# Altium schematic sheet 03_MCU.SchDoc: ECE315 MCU
size A; Date: 4/25/2017; ApprovedBy: JSK; CheckedBy: JSK; Author: JSK; CompanyName: University of Wisconsin; DrawnBy: JSK; Engineer: JSK; Organization: ECE 315; Address1: College of Engineering; Address2: 1415 Engineering Drive; Address3: Madison, WI 53706; Address4: ECE 315 Fall 2017; Revision: A; SheetNumber: 3; SheetTotal: 6; AssemblyNumber: 0; MachineName: ECE315-S19; PCBNumber: 001; ApprovedDate: 1/17/2019
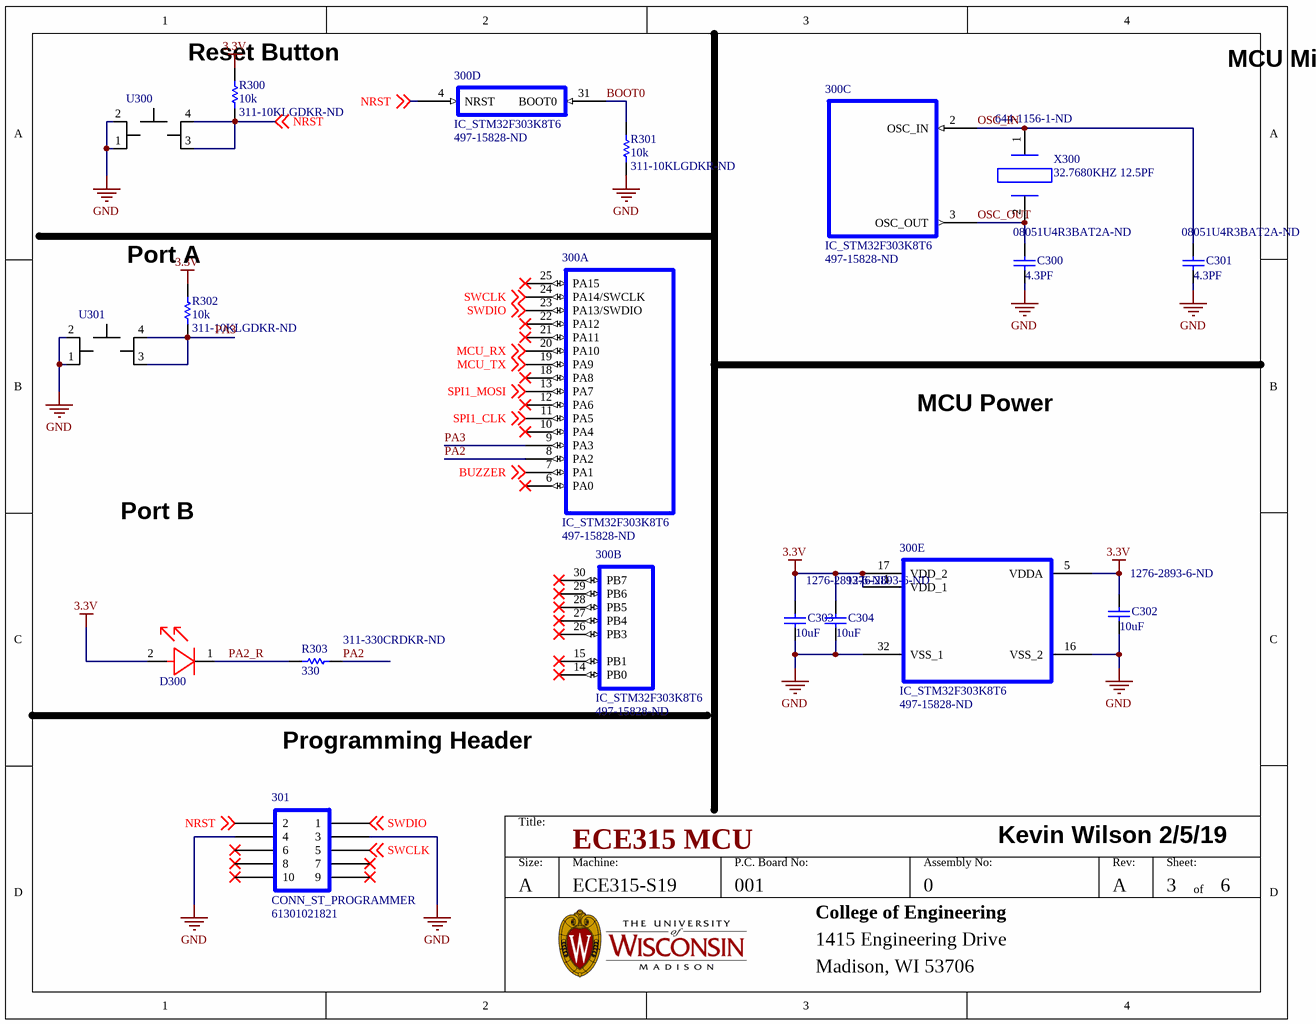
[diagram p0: 03_MCU.SchDoc]

## Parts
300  IC_STM32F303K8T6  Supplier Part Number 1: 497-15828-ND  [IC_STM32FM]  (parts A,B,C,D,E of 5)
301  CONN_ST_PROGRAMMER  Manufacturer Part Number: 61301021821  [CONN_ST_PROGRAMMER]
C300  4.3PF  Supplier Part Number 1: 08051U4R3BAT2A-ND  [CAP_0805]
C301  4.3PF  Supplier Part Number 1: 08051U4R3BAT2A-ND  [CAP_0805]
C302  10uF  Supplier Part Number 1: 1276-2893-6-ND  [CAP_0805]
C303  10uF  Supplier Part Number 1: 1276-2893-6-ND  [CAP_0805]
C304  10uF  Supplier Part Number 1: 1276-2893-6-ND  [CAP_0805]
D300  LED_RED_0805.1  [LED_RED_0805]  (value not drawn)
R300  Supplier Part Number 1: 311-10KLGDKR-ND  [RES_0805]  (hidden comment: 10K)
R301  Supplier Part Number 1: 311-10KLGDKR-ND  [RES_0805]  (hidden comment: 10K)
R302  Supplier Part Number 1: 311-10KLGDKR-ND  [RES_0805]  (hidden comment: 10K)
R303  Supplier Part Number 1: 311-330CRDKR-ND  [RES_0805]  (hidden comment: 330)
U300  SWITCH_6mm_6mm_smd  [SW_6mm_6mm_SMT]  (value not drawn)
U301  SWITCH_6mm_6mm_smd  [SW_6mm_6mm_SMT]  (value not drawn)
X300  32.7680KHZ 12.5PF  Supplier Part Number 2: 644-1156-1-ND  [NX3215SA-32.768K-STD-MUA-8]

## Nets
3.3V: 300.1(VDD_1) 300.5(VDDA) 300.17(VDD_2) C302.1 C303.1 C304.1 D300.2(Anode) R300.2 R302.2
GND: 300.16(VSS_2) 300.32(VSS_1) 301.?2(3) 301.?9(4) C300.1 C301.1 C302.2 C303.2 C304.2 R301.1 U300.1 U300.2 U301.1 U301.2
BOOT0: 300.31(BOOT0) R301.2
BUZZER: 300.7(PA1) ; off-sheet BUZZER
MCU_RX: 300.20(PA10) ; off-sheet MCU_RX
MCU_TX: 300.19(PA9) ; off-sheet MCU_TX
NRST: 300.4(NRST) 301.?10(2) R300.1 U300.3 U300.4(VCCIO) ; off-sheet NRST
OSC_IN: 300.2(OSC_IN) C301.2 X300.1
OSC_OUT: 300.3(OSC_OUT) C300.2 X300.2
PA2: 300.8(PA2) R303.1
PA2_R: D300.1(Cathode) R303.2
PA3: 300.9(PA3) R302.1 U301.3 U301.4(VCCIO)
SPI1_CLK: 300.11(PA5) ; off-sheet SPI1_CLK
SPI1_MOSI: 300.13(PA7) ; off-sheet SPI1_MOSI
SWCLK: 300.24(PA14/SWCLK) 301.?3(5) ; off-sheet SWCLK
SWDIO: 300.23(PA13/SWDIO) 301.?1(1) ; off-sheet SWDIO

Not connected (* = marked no-connect by the designer): 300 6(PA0)* 10(PA4)* 12(PA6)* 14(PB0)* 15(PB1)* 18(PA8)* 21(PA11)* 22(PA12)* 25(PA15)* 26(PB3)* 27(PB4)* 28(PB5)* 29(PB6)* 30(PB7)*; 301 ?4(7)* ?5(9)* ?6(10)* ?7(8)* ?8(6)*

## Notes on the sheet
- Reset Button
- MCU Misc
- Port A
- MCU Power
- Port B
- Programming Header
- Kevin Wilson 2/5/19
- Title:
- Size:
- A
- Machine:
- P.C. Board No:
- Assembly No:
- Rev:
- Sheet:
- of
- College of Engineering
- 1415 Engineering Drive
- Madison, WI 53706

## Library data of the parts
301 = CONN_ST_PROGRAMMER: Manufacturer: Wurth Electronics; Current Rating: 3A; Voltage Rating: 250V; Number of Positions: 10; Insulation Resistance: 1GR; Gender: Receptacle; Connector Type: Header,Socket; Pitch: 2.54mm; Row Spacing: 0.1inch; Supplier 1: Digi-Key; Stock 1: 1798; Pricing 1: 1=0.74, 10=0.728, 50=0.672, 100=0.616, 320=0.56 (USD); Mount: Through Hole; Contact Plating: Gold; Housing Material: PBT; Contact Material: Copper,Copper Alloy; Color: Black; Min Operating Temperature: -40°C; Max Operating Temperature: 125°C; Number of Rows: 2; Contact Gender: Female; Packaging: Tray; Package Quantity: 320; Termination: Solder; Number of Contacts: 10; Length: 5.08mm; Height: 12.5mm; Width: 13.2mm; REACH SVHC: Unknown; Flammability Rating: UL94 V-0; ComponentLink1URL: http://www.mouser.com/ds/2/445/6130xx21821-537816.pdf; ComponentLink1Description: http://www.mouser.com/ds/2/445/6130xx21821-537816.pdf; ComponentLink2URL: https://katalog.we-online.de/em/datasheet/6130xx21821.pdf; ComponentLink2Description: https://katalog.we-online.de/em/datasheet/6130xx21821.pdf; ComponentLink3URL: http://www.farnell.com/datasheets/1442176.pdf; ComponentLink3Description: http://www.farnell.com/datasheets/1442176.pdf; Supplier Part Number 1: 732-2861-ND
C300 C301 = CAP_0805_P_004.30: CAP CER 4.3PF 100V NP0 0805; Manufacturer: Kyocera AVX; Manufacturer Part Number: 08051U4R3BAT2A; Dielectric: C0G; ComponentLink1URL: https://datasheet.ciiva.com/204/ccog-204944.pdf; ComponentLink1Description: https://datasheet.ciiva.com/204/ccog-204944.pdf; ComponentLink2URL: https://datasheet.ciiva.com/11570/ccog-11570969.pdf; ComponentLink2Description: https://datasheet.ciiva.com/11570/ccog-11570969.pdf; Supplier 1: Digi-Key; Stock 1: 0; Pricing 1: 4000=0.14663 (USD); Mount: Surface Mount; Case/Package: 0805; Case Code (Imperial): 0805; Case Code (Metric): 2012; Min Operating Temperature: -55°C; Max Operating Temperature: 125°C; Capacitance: 4.3pF; Package Quantity: 4000; Voltage Rating: 100V; Voltage Rating (DC): 100V; Packaging: Tape and Reel; Termination: SMD/SMT; Composition: Ceramic; Length: 2.01mm; Height: 1.02mm; Width: 1.25mm; Thickness: 0.045inch; Depth: 1.25mm; Radiation Hardening: No; ComponentLink3URL: http://datasheets.avx.com/U-Series.pdf; ComponentLink3Description: http://datasheets.avx.com/U-Series.pdf; ComponentLink4URL: http://www.avxcorp.com/docs/Catalogs/useries.pdf; ComponentLink4Description: http://www.avxcorp.com/docs/Catalogs/useries.pdf
C302-C304 = CAP_0805_U_010.00: CAP CER 10UF 16V X5R 0805; Manufacturer: Samsung; Manufacturer Part Number: CL21A106KOFNNNE; Tolerance: 10%; ComponentLink3URL: https://datasheet.ciiva.com/26920/getdatasheetpartid-355170-26920201.pdf; ComponentLink3Description: https://datasheet.ciiva.com/26920/getdatasheetpartid-355170-26920201.pdf; ComponentLink1URL: https://datasheet.ciiva.com/25730/cl21a106kpclqnc-25730594.pdf; ComponentLink1Description: https://datasheet.ciiva.com/25730/cl21a106kpclqnc-25730594.pdf; Mount: Surface Mount; Case/Package: 0805; Case Code (Metric): 2012; Case Code (Imperial): 0805; Min Operating Temperature: -55°C; Max Operating Temperature: 85°C; Packaging: Tape and Reel; Capacitance: 10uF; Voltage Rating: 16V; Package Quantity: 2000; Dielectric: X5R; Length: 2mm; Height: 1.25mm; Width: 0.049inch; Thickness: 0.053inch; Depth: 1.25mm; Radiation Hardening: No; ComponentLink2URL: http://www.samsungsem.com/kr/support/product-search/mlcc/CL21A106KOFNNNE.jsp; ComponentLink2Description: http://www.samsungsem.com/kr/support/product-search/mlcc/CL21A106KOFNNNE.jsp; ComponentLink4URL: http://www1.futureelectronics.com/doc/SAMSUNG/CL21A106KOFNNNE.pdf; ComponentLink4Description: http://www1.futureelectronics.com/doc/SAMSUNG/CL21A106KOFNNNE.pdf; ComponentLink5URL: https://www.verical.com/server-webapp/html/getDatasheet?partID=354009; ComponentLink5Description: https://www.verical.com/server-webapp/html/getDatasheet?partID=354009; Supplier 1: Digi-Key; Stock 1: 1158169; Pricing 1: 1=0.29, 10=0.199, 100=0.1009, 500=0.06904, 1000=0.06107 (USD)
D300 = LED_RED_0805.1: LED SUPER RED CLR THIN 0805 SMD; Manufacturer: Vishay / Lite-On; Manufacturer Part Number: LTST-C171KRKT; Chip Material: AlGaInP; DELETED: Compliant; Dominant Wave Length: 631 nm; Forward Current: 30 mA; Forward Voltage: 2.4 V; High Brightness: Yes; Lum Intensity: 54mcd; Main Category: Chip LED; Number of  Elements: 1; Peak Wavelength: 639 nm; Power Dissipation: 75 W; Product Depth (mm): 1.25 mm; Product Height (mm): 0.8 mm; Product Length (mm): 2 mm; Rad Hardened: No; Reverse Voltage: 5 V; Shape Type: Rectangular; Test Current (It): 20 mA; Type: Uni-Color; Viewing Angle: 130 deg; Supplier 1: Digi-Key; Emitting Color: Red; Lens Dimensions: 1.4x1.25x0.5 mm; Luminous Intensity: 54mcd; Mounting: Surface Mount; Operating Temp Range: -55C to 85C; Operating Temperature Classification: Industrial; Package Type: Chip Led; Packaging: Tape and Reel; Pin Count: 2; ComponentLink1URL: https://datasheet.ciiva.com/2110/s-110-ltst-c171krkt-2110066.pdf; ComponentLink1Description: https://datasheet.ciiva.com/2110/s-110-ltst-c171krkt-2110066.pdf; ComponentLink2URL: https://datasheet.ciiva.com/2110/s-110-ltst-c171krkt-2110067.pdf; ComponentLink2Description: https://datasheet.ciiva.com/2110/s-110-ltst-c171krkt-2110067.pdf; ComponentLink3URL: https://datasheet.ciiva.com/2110/s-110-ltst-c171krkt-2110068.pdf; ComponentLink3Description: https://datasheet.ciiva.com/2110/s-110-ltst-c171krkt-2110068.pdf; ComponentLink4URL: https://datasheet.ciiva.com/12403/lite-on-ltst-c171krkt-187201-12403781.pdf; ComponentLink4Description: https://datasheet.ciiva.com/12403/lite-on-ltst-c171krkt-187201-12403781.pdf; ComponentLink5URL: https://datasheet.ciiva.com/11775/0900766b80dc0299-11775643.pdf; ComponentLink5Description: https://datasheet.ciiva.com/11775/0900766b80dc0299-11775643.pdf; ComponentLink6URL: https://datasheet.ciiva.com/16444/lite-on20ltst-c171krkt-16444779.pdf; ComponentLink6Description: https://datasheet.ciiva.com/16444/lite-on20ltst-c171krkt-16444779.pdf; Supplier Part Number 1: LTST-C171KEKTCT-ND
R300-R302 = RES_0805_K_010.00: RES SMD 10K OHM 1% 1/8W 0805; Manufacturer: Panasonic / Panasonic ECG; Manufacturer Part Number: ERJ-6ENF1002V; Power Rating: 125mW; Temperature Coefficient: ± 200ppm/°C; Voltage Rating: 150V; Resistor Element Material: Thick Film; Resistor Case Style: 0805; No. of Pins: 2; Product Range: PANASONIC - ERJ Series; Series: ERJ; Resistance Tolerance: ± 1%; Resistor Mounting: SMD; Resistor Element Type: Thick Film; ComponentLink1URL: https://datasheet.ciiva.com/11808/0900766b80f80784-11808080.pdf; ComponentLink1Description: https://datasheet.ciiva.com/11808/0900766b80f80784-11808080.pdf; ComponentLink2URL: https://datasheet.ciiva.com/16514/aoa0000ce2-16514021.pdf; ComponentLink2Description: https://datasheet.ciiva.com/16514/aoa0000ce2-16514021.pdf; ComponentLink3URL: https://datasheet.ciiva.com/27055/1988971-27055733.pdf; ComponentLink3Description: https://datasheet.ciiva.com/27055/1988971-27055733.pdf; ComponentLink4URL: https://datasheet.ciiva.com/16759/70260748-16759350.pdf; ComponentLink4Description: https://datasheet.ciiva.com/16759/70260748-16759350.pdf; ComponentLink5URL: https://datasheet.ciiva.com/16725/70260748-16725031.pdf; ComponentLink5Description: https://datasheet.ciiva.com/16725/70260748-16725031.pdf; ComponentLink6URL: https://datasheet.ciiva.com/7830/426256-7830745.pdf; ComponentLink6Description: https://datasheet.ciiva.com/7830/426256-7830745.pdf; ComponentLink7URL: https://datasheet.ciiva.com/46372/1678782-46372714.pdf; ComponentLink7Description: https://datasheet.ciiva.com/46372/1678782-46372714.pdf; ComponentLink8URL: https://datasheet.ciiva.com/46372/1678782-46372715.pdf; ComponentLink8Description: https://datasheet.ciiva.com/46372/1678782-46372715.pdf; ComponentLink9URL: https://datasheet.ciiva.com/17212/aoa0000ce2-17212108.pdf; ComponentLink9Description: https://datasheet.ciiva.com/17212/aoa0000ce2-17212108.pdf; ComponentLink10URL: https://datasheet.ciiva.com/30140/aoa0000ce2-30140236.pdf; ComponentLink10Description: https://datasheet.ciiva.com/30140/aoa0000ce2-30140236.pdf; ComponentLink11URL: https://datasheet.ciiva.com/16740/aoa0000ce2-16740669.pdf; ComponentLink11Description: https://datasheet.ciiva.com/16740/aoa0000ce2-16740669.pdf; ComponentLink12URL: https://datasheet.ciiva.com/24070/aoa0000ce2-24070702.pdf; ComponentLink12Description: https://datasheet.ciiva.com/24070/aoa0000ce2-24070702.pdf; Case/Package: 0805; Case Code (Imperial): 0805; Case Code (Metric): 2012; Min Operating Temperature: -55°C; Max Operating Temperature: 155°C; Packaging: Tape and Reel; Tolerance: 1%; Package Quantity: 1; Termination: SMD/SMT; Composition: Thick Film; Number of Terminations: 2; Military Standard: Not; Max Power Dissipation: 125mW; Features: Moisture Resistant; Length: 2mm; Height: 0.024inch; Width: 0.049inch; Depth: 1.25mm; REACH SVHC: Unknown; Lead Free: Lead Free; ComponentLink13URL: http://www.yageo.com/documents/recent/PYu-RC_Group_51_RoHS_L_9.pdf; ComponentLink13Description: http://www.yageo.com/documents/recent/PYu-RC_Group_51_RoHS_L_9.pdf; ComponentLink14URL: http://www.farnell.com/datasheets/444164.pdf; ComponentLink14Description: http://www.farnell.com/datasheets/444164.pdf; ComponentLink15URL: http://www.yageo.com/documents/recent/PYu-RC_Group_51_RoHS_L_10.pdf; ComponentLink15Description: http://www.yageo.com/documents/recent/PYu-RC_Group_51_RoHS_L_10.pdf; ComponentLink16URL: http://www.yageo.ru/pdf/RC0805.pdf; ComponentLink16Description: http://www.yageo.ru/pdf/RC0805.pdf; Supplier 1: Digi-Key; Stock 1: 802268; Pricing 1: 1=0.1, 10=0.05, 100=0.0205, 1000=0.00921, 2500=0.00799 (USD); ComponentLink17URL: http://www.yageo.com/NewPortal/yageodocoutput?fileName=/pdf/R-Chip/PYu-AC_51_RoHS_L_6.pdf; ComponentLink17Description: http://www.yageo.com/NewPortal/yageodocoutput?fileName=/pdf/R-Chip/PYu-AC_51_RoHS_L_6.pdf; Resistance: 10k
R303 = RES_0805_R_330.00: RES SMD 330 OHM 1% 1/8W 0805; Manufacturer: Panasonic / Panasonic ECG; Manufacturer Part Number: ERJ-6ENF3300V; Temperature Coefficient: ± 200ppm/°C; Voltage Rating: 150V; SVHC: To Be Advised; Product Range: PANASONIC - ERJ Series; Power Rating: 125mW; Resistor Case Style: 0805 ^2012 Metric]; Resistor Element Type: Thick Film; Packaging: Full Reel; Resistance Tolerance: ± 1%; ComponentLink1URL: https://datasheet.ciiva.com/11821/0900766b80f80784-11821635.pdf; ComponentLink1Description: https://datasheet.ciiva.com/11821/0900766b80f80784-11821635.pdf; ComponentLink2URL: https://datasheet.ciiva.com/30131/aoa0000ce2-30131349.pdf; ComponentLink2Description: https://datasheet.ciiva.com/30131/aoa0000ce2-30131349.pdf; ComponentLink3URL: https://datasheet.ciiva.com/24025/aoa0000ce2-24025991.pdf; ComponentLink3Description: https://datasheet.ciiva.com/24025/aoa0000ce2-24025991.pdf; ComponentLink4URL: https://datasheet.ciiva.com/17206/aoa0000ce2-17206152.pdf; ComponentLink4Description: https://datasheet.ciiva.com/17206/aoa0000ce2-17206152.pdf; ComponentLink5URL: https://datasheet.ciiva.com/46436/1678782-46436633.pdf; ComponentLink5Description: https://datasheet.ciiva.com/46436/1678782-46436633.pdf; ComponentLink6URL: https://datasheet.ciiva.com/46436/1678782-46436634.pdf; ComponentLink6Description: https://datasheet.ciiva.com/46436/1678782-46436634.pdf; ComponentLink7URL: https://datasheet.ciiva.com/16760/70260748-16760668.pdf; ComponentLink7Description: https://datasheet.ciiva.com/16760/70260748-16760668.pdf; ComponentLink8URL: https://datasheet.ciiva.com/16780/70260748-16780764.pdf; ComponentLink8Description: https://datasheet.ciiva.com/16780/70260748-16780764.pdf; ComponentLink9URL: https://datasheet.ciiva.com/22684/1678782-22684798.pdf; ComponentLink9Description: https://datasheet.ciiva.com/22684/1678782-22684798.pdf; ComponentLink10URL: https://datasheet.ciiva.com/28590/1678782-28590783.pdf; ComponentLink10Description: https://datasheet.ciiva.com/28590/1678782-28590783.pdf; Supplier 1: Digi-Key; Stock 1: 3197096; Pricing 1: 1=0.1, 10=0.042, 100=0.017, 1000=0.00762, 2500=0.00662 (USD); Case/Package: 0805; Case Code (Imperial): 0805; Case Code (Metric): 2012; Min Operating Temperature: -55°C; Max Operating Temperature: 155°C; Tolerance: 1%; Composition: Thick Film; Package Quantity: 1; Number of Terminations: 2; Military Standard: Not; Termination: SMD/SMT; Max Power Dissipation: 125mW; Features: Moisture Resistant; Length: 2mm; Height: 0.024inch; Width: 0.049inch; Depth: 1.25mm; REACH SVHC: Unknown; Lead Free: Lead Free; ComponentLink11URL: http://www.yageo.ru/pdf/RC0805.pdf; ComponentLink11Description: http://www.yageo.ru/pdf/RC0805.pdf; ComponentLink12URL: http://www.yageo.com/documents/recent/PYu-RC_Group_51_RoHS_L_9.pdf; ComponentLink12Description: http://www.yageo.com/documents/recent/PYu-RC_Group_51_RoHS_L_9.pdf; ComponentLink13URL: http://www.yageo.com/documents/recent/PYu-RC_Group_51_RoHS_L_10.pdf; ComponentLink13Description: http://www.yageo.com/documents/recent/PYu-RC_Group_51_RoHS_L_10.pdf; ComponentLink14URL: http://www.yageo.com.tw/exep/pages/download/literatures/PYu-R_INT-thick_7.pdf; ComponentLink14Description: http://www.yageo.com.tw/exep/pages/download/literatures/PYu-R_INT-thick_7.pdf; ComponentLink15URL: http://www.farnell.com/datasheets/444164.pdf; ComponentLink15Description: http://www.farnell.com/datasheets/444164.pdf; Resistance: 330
U300 U301 = SWITCH_6mm_6mm_smd: SWITCH TACTILE SPST-NO 0.05A 12V; Manufacturer: C&K Components; Manufacturer Part Number: PTS645SH50SMTR92 LFS; Operating Force: 200gf; Illumination: Non-Illuminated; Switch Function: Off-Mom; Actuator Height off PCB, from Pins: 5.00mm; Actuator Type: Standard; Actuator Material: Polyamide (PA66), Nylon 6/6; Contact Rating @ Voltage: 0.05A @ 12VDC; Actuator Orientation: Top Actuated; Outline: 6.00mm x 6.00mm; Mechanical Life: 100,000 Cycles; Throw Configuration: SPST; Current Rating: 50mA; Illumination Type, Color: -; Packaging: Tape & Reel (TR); Illumination Voltage (Nominal): -; Ingress Protection: -; Switch Travel: -; Category: Switches; Circuit: SPST-NO; Supplier: Digi-Key; Termination Style: Gull Wing; Features: -; Mounting Type: Surface Mount; Operating Temperature: -20°C ~ 60°C; RoHS: RoHS Compliant; Supplier Part Number: CKN9085TR-ND; Supplier 1: Mouser; Supplier Part Number 1: 611-PTS530GG065SMTR; Mount: Surface Mount; Contact Plating: Silver; Min Operating Temperature: -40°C; Max Operating Temperature: 85°C; Package Quantity: 7000; Termination: Gull Wing; Illumination Type: Non-Illuminated; Voltage Rating (DC): 12V; ComponentLink1URL: http://www.mouser.com/ds/2/60/pts530_4mar13-305907.pdf; ComponentLink1Description: http://www.mouser.com/ds/2/60/pts530_4mar13-305907.pdf; ComponentLink2URL: http://www.ck-components.com/80182/pts530_4mar13.pdf/; ComponentLink2Description: http://www.ck-components.com/80182/pts530_4mar13.pdf/; Stock 1: 36566; Pricing 1: 1=0.24, 10=0.229, 50=0.213, 100=0.202, 1000=0.138, 10000=0.104 (USD)
X300 = CRYSTAL_NX3215SA-32.768K: CRYSTAL 32.768KHZ 12.5PF SMD; Manufacturer: Nihon Dempa Kogyo (NDK); Catalog Drawings: NX3215SA Series Top / NX3215SA Series Side / NX3215SA Series Bottom / NX3215SA Series Circuit; Featured Product: NX3215SA Series 32.768KHz SMD Crystals; Frequency Tolerance: ±20ppm; ESR (Equivalent Series Resistance): 70 kOhm; Operating Mode: Fundamental; Dynamic Catalog: NX3215SA Series; Other Names: 644-1156-6; Supplier 1: Digikey; Stock 1: 45314; Pricing 1: 1=0.94, 10=0.835, 50=0.7804, 100=0.6897, 500=0.6534, 1000=0.5445 (USD); Standard Package: 1; Category: Crystals and Oscillators; Family: Crystals; Series: NX3215SA; Type: kHz Crystal (Tuning Fork); Frequency: 32.768kHz; Load Capacitance: 12.5pF; Operating Temperature: -40°C ~ 85°C; Mounting Type: Surface Mount; Package / Case: 2-SMD; Size / Dimension: 0.126" L x 0.059" W (3.20mm x 1.50mm); Height: 0.035" (0.90mm); Packaging: Digi-Reel®; ComponentLink1URL: https://datasheet.ciiva.com/857/c-nx3215sa-std-mua-9-e-857050.pdf; ComponentLink1Description: https://datasheet.ciiva.com/857/c-nx3215sa-std-mua-9-e-857050.pdf; ComponentLink2URL: https://datasheet.ciiva.com/857/c-nx3215sa-std-mua-9-e-857051.pdf; ComponentLink2Description: https://datasheet.ciiva.com/857/c-nx3215sa-std-mua-9-e-857051.pdf; ComponentLink3URL: https://datasheet.ciiva.com/857/c-nx3215sa-std-mua-9-e-857052.pdf; ComponentLink3Description: https://datasheet.ciiva.com/857/c-nx3215sa-std-mua-9-e-857052.pdf; Supplier Part Number 1: 644-1156-1-ND; Manufacturer Part Number: NX3215SA-32.768K-STD-MUA-8; Supplier 2: Digi-Key
300 = IC_STM32F303K8T6: Supplier 1: Digi-Key